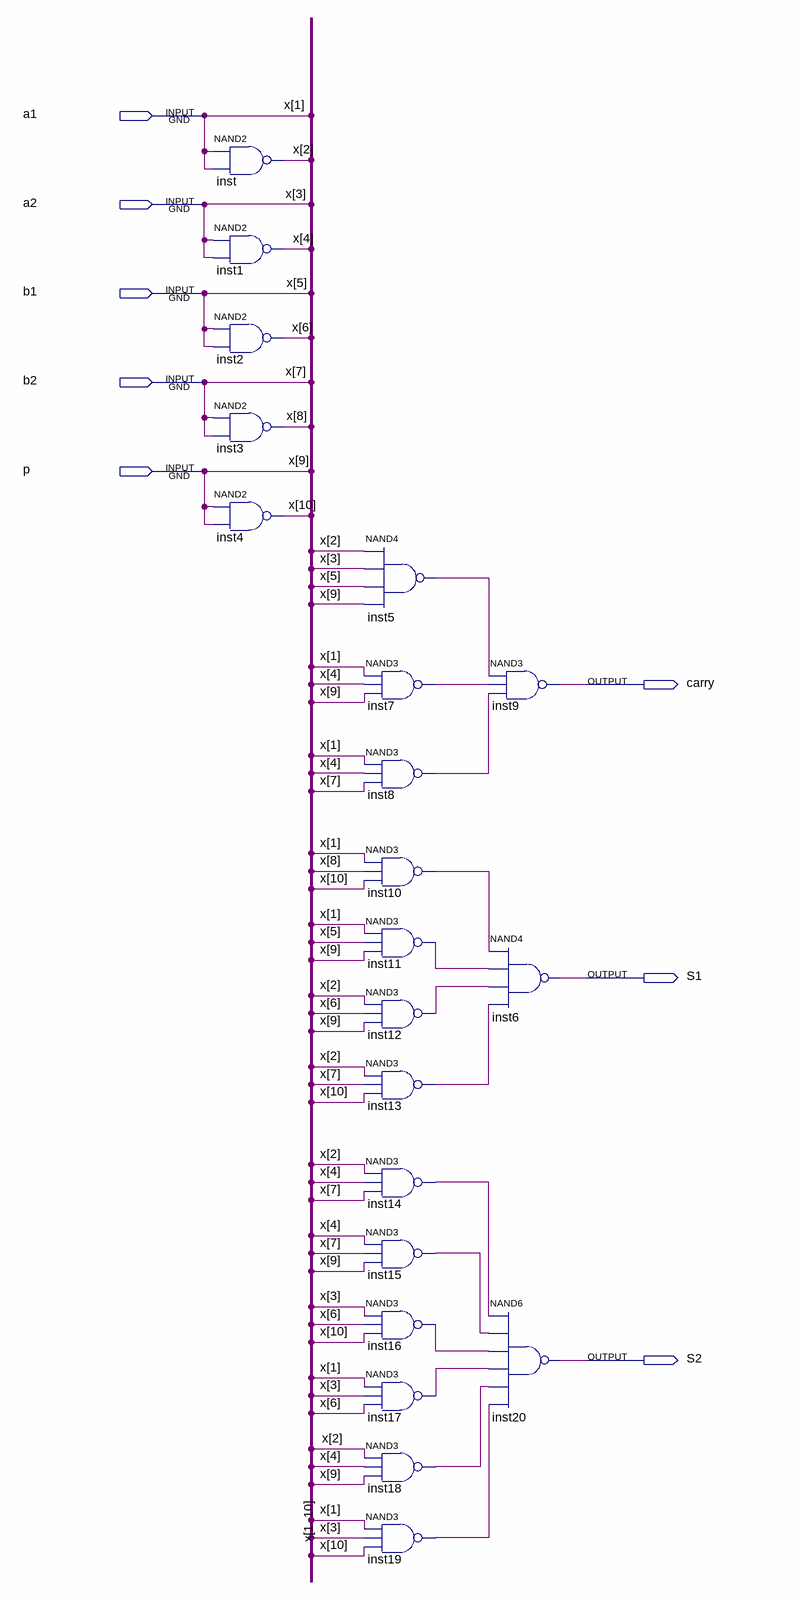
[diagram p0: schematic sheet]
// Quartus schematic ochs.bdf as structural Verilog: 21 symbols, 8 pins
module ochs (
  input  a1,
  input  a2,
  input  b1,
  input  b2,
  input  p,
  output carry,
  output S1,
  output S2
);

  wire inst5_out, inst7_out, inst8_out, inst10_out, inst11_out, inst12_out, inst13_out, inst14_out,
       inst15_out, inst16_out, inst17_out, inst18_out, inst19_out;
  wire [10:2] x;

  nand inst (x[2], a1, a1);
  nand inst1 (x[4], a2, a2);
  nand inst2 (x[6], b1, b1);
  nand inst3 (x[8], b2, b2);
  nand inst4 (x[10], p, p);
  nand inst5 (inst5_out, x[2], a2, b1, p);
  nand inst7 (inst7_out, a1, x[4], p);
  nand inst8 (inst8_out, a1, x[4], b2);
  nand inst10 (inst10_out, a1, x[8], x[10]);
  nand inst11 (inst11_out, a1, b1, p);
  nand inst12 (inst12_out, x[2], x[6], p);
  nand inst13 (inst13_out, x[2], b2, x[10]);
  nand inst14 (inst14_out, x[2], x[4], b2);
  nand inst15 (inst15_out, x[4], b2, p);
  nand inst16 (inst16_out, a2, x[6], x[10]);
  nand inst17 (inst17_out, a1, a2, x[6]);
  nand inst18 (inst18_out, x[2], x[4], p);
  nand inst19 (inst19_out, a1, a2, x[10]);
  nand inst9 (carry, inst5_out, inst7_out, inst8_out);
  nand inst6 (S1, inst10_out, inst11_out, inst12_out, inst13_out);
  nand inst20 (S2, inst14_out, inst15_out, inst16_out, inst17_out, inst18_out, inst19_out);

  // Other names for the same wires on the sheet: x (some bits) = {p, b2, b1, a2, a1}
endmodule
